# Altium schematic sheet Adelais.SchDoc
size A; SheetNumber: 1; SheetTotal: 1
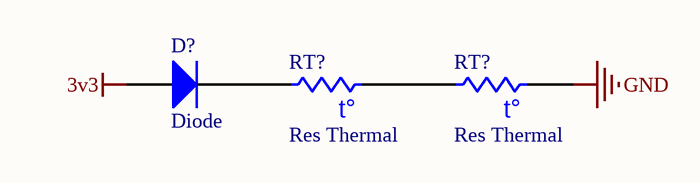
[diagram p0: Adelais.SchDoc]

## Parts
(Parts that share a designator on the sheet are numbered #1, #2 ... from top to bottom, then left to right.)
D?  Diode  [SMC]
RT?#1  Res Thermal  [6-0805_N]
RT?#2  Res Thermal  [6-0805_N]

## Nets
3v3: D?.1(A)
GND: RT?#2.1
NetD?_2: D?.2(K) RT?#1.2
NetRT?#1_1: RT?#1.1 RT?#2.2

## Notes on the sheet
- (in symbol Res Thermal) t°

## Library data of the parts
D? = Diode: Default Diode; Published: 8-Jun-2000; LatestRevisionDate: 17-Jul-2002; LatestRevisionNote: Re-released for DXP Platform.; PackageVersion: Sep-1996; PackageReference: SMC; Publisher: Altium Limited; PackageDescription: DO-214-AB/SMC; 2 C-Bend Leads; Body 7.9 x 5.9 mm, inc. leads (LxW); Code_JEDEC: DO-214-AB
RT?#1 RT?#2 = Res Thermal: Thermistor; Published: 24-Mar-1999; LatestRevisionDate: 29-May-2009; LatestRevisionNote: IPC-7351 Footprint Added.; PackageVersion: Mar-2003; PackageReference: 6-0805; Publisher: Altium Limited; PackageDescription: Chip Resistor 0805 Case Size; Code_IPC: RESC2012